# Altium schematic sheet Drive Select.SchDoc
size B; SheetNumber: 14; SheetTotal: 14
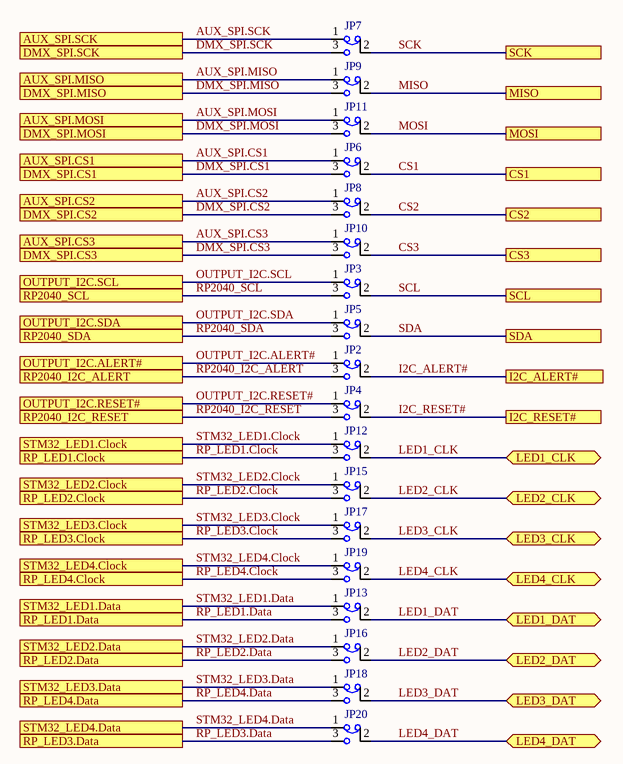
[diagram p0: Drive Select.SchDoc]

## Parts
JP2  Jumper 3 x 1 Bridge 1-2 Solder Bridge  [Jumper 3 Solder Bridge 1-2 0603]  (value not drawn)
JP3  Jumper 3 x 1 Bridge 1-2 Solder Bridge  [Jumper 3 Solder Bridge 1-2 0603]  (value not drawn)
JP4  Jumper 3 x 1 Bridge 1-2 Solder Bridge  [Jumper 3 Solder Bridge 1-2 0603]  (value not drawn)
JP5  Jumper 3 x 1 Bridge 1-2 Solder Bridge  [Jumper 3 Solder Bridge 1-2 0603]  (value not drawn)
JP6  Jumper 3 x 1 Bridge 1-2 Solder Bridge  [Jumper 3 Solder Bridge 1-2 0603]  (value not drawn)
JP7  Jumper 3 x 1 Bridge 1-2 Solder Bridge  [Jumper 3 Solder Bridge 1-2 0603]  (value not drawn)
JP8  Jumper 3 x 1 Bridge 1-2 Solder Bridge  [Jumper 3 Solder Bridge 1-2 0603]  (value not drawn)
JP9  Jumper 3 x 1 Bridge 1-2 Solder Bridge  [Jumper 3 Solder Bridge 1-2 0603]  (value not drawn)
JP10  Jumper 3 x 1 Bridge 1-2 Solder Bridge  [Jumper 3 Solder Bridge 1-2 0603]  (value not drawn)
JP11  Jumper 3 x 1 Bridge 1-2 Solder Bridge  [Jumper 3 Solder Bridge 1-2 0603]  (value not drawn)
JP12  Jumper 3 x 1 Bridge 1-2 Solder Bridge  [Jumper 3 Solder Bridge 1-2 0603]  (value not drawn)
JP13  Jumper 3 x 1 Bridge 1-2 Solder Bridge  [Jumper 3 Solder Bridge 1-2 0603]  (value not drawn)
JP15  Jumper 3 x 1 Bridge 1-2 Solder Bridge  [Jumper 3 Solder Bridge 1-2 0603]  (value not drawn)
JP16  Jumper 3 x 1 Bridge 1-2 Solder Bridge  [Jumper 3 Solder Bridge 1-2 0603]  (value not drawn)
JP17  Jumper 3 x 1 Bridge 1-2 Solder Bridge  [Jumper 3 Solder Bridge 1-2 0603]  (value not drawn)
JP18  Jumper 3 x 1 Bridge 1-2 Solder Bridge  [Jumper 3 Solder Bridge 1-2 0603]  (value not drawn)
JP19  Jumper 3 x 1 Bridge 1-2 Solder Bridge  [Jumper 3 Solder Bridge 1-2 0603]  (value not drawn)
JP20  Jumper 3 x 1 Bridge 1-2 Solder Bridge  [Jumper 3 Solder Bridge 1-2 0603]  (value not drawn)

## Ports
AUX_SPI.CS1, AUX_SPI.CS2, AUX_SPI.CS3, AUX_SPI.MISO, AUX_SPI.MOSI, AUX_SPI.SCK, CS1, CS2, CS3, DMX_SPI.CS1, DMX_SPI.CS2, DMX_SPI.CS3, DMX_SPI.MISO, DMX_SPI.MOSI, DMX_SPI.SCK, I2C_ALERT#, I2C_RESET#, LED1_CLK (bidir), LED1_DAT (bidir), LED2_CLK (bidir), LED2_DAT (bidir), LED3_CLK (bidir), LED3_DAT (bidir), LED4_CLK (bidir), LED4_DAT (bidir), MISO, MOSI, OUTPUT_I2C.ALERT#, OUTPUT_I2C.RESET#, OUTPUT_I2C.SCL, OUTPUT_I2C.SDA, RP2040_I2C_ALERT, RP2040_I2C_RESET, RP2040_SCL, RP2040_SDA, RP_LED1.Clock, RP_LED1.Data, RP_LED2.Clock, RP_LED2.Data, RP_LED3.Clock, RP_LED3.Data, RP_LED4.Clock, RP_LED4.Data, SCK, SCL, SDA, STM32_LED1.Clock, STM32_LED1.Data, STM32_LED2.Clock, STM32_LED2.Data, STM32_LED3.Clock, STM32_LED3.Data, STM32_LED4.Clock, STM32_LED4.Data

## Nets
AUX_SPI.CS1: JP6.1 ; port AUX_SPI.CS1
AUX_SPI.CS2: JP8.1 ; port AUX_SPI.CS2
AUX_SPI.CS3: JP10.1 ; port AUX_SPI.CS3
AUX_SPI.MISO: JP9.1 ; port AUX_SPI.MISO
AUX_SPI.MOSI: JP11.1 ; port AUX_SPI.MOSI
AUX_SPI.SCK: JP7.1 ; port AUX_SPI.SCK
CS1: JP6.2 ; port CS1
CS2: JP8.2 ; port CS2
CS3: JP10.2 ; port CS3
DMX_SPI.CS1: JP6.3 ; port DMX_SPI.CS1
DMX_SPI.CS2: JP8.3 ; port DMX_SPI.CS2
DMX_SPI.CS3: JP10.3 ; port DMX_SPI.CS3
DMX_SPI.MISO: JP9.3 ; port DMX_SPI.MISO
DMX_SPI.MOSI: JP11.3 ; port DMX_SPI.MOSI
DMX_SPI.SCK: JP7.3 ; port DMX_SPI.SCK
I2C_ALERT#: JP2.2 ; port I2C_ALERT#
I2C_RESET#: JP4.2 ; port I2C_RESET#
LED1_CLK: JP12.2 ; port LED1_CLK
LED1_DAT: JP13.2 ; port LED1_DAT
LED2_CLK: JP15.2 ; port LED2_CLK
LED2_DAT: JP16.2 ; port LED2_DAT
LED3_CLK: JP17.2 ; port LED3_CLK
LED3_DAT: JP18.2 ; port LED3_DAT
LED4_CLK: JP19.2 ; port LED4_CLK
LED4_DAT: JP20.2 ; port LED4_DAT
MISO: JP9.2 ; port MISO
MOSI: JP11.2 ; port MOSI
OUTPUT_I2C.ALERT#: JP2.1 ; port OUTPUT_I2C.ALERT#
OUTPUT_I2C.RESET#: JP4.1 ; port OUTPUT_I2C.RESET#
OUTPUT_I2C.SCL: JP3.1 ; port OUTPUT_I2C.SCL
OUTPUT_I2C.SDA: JP5.1 ; port OUTPUT_I2C.SDA
RP2040_I2C_ALERT: JP2.3 ; port RP2040_I2C_ALERT
RP2040_I2C_RESET: JP4.3 ; port RP2040_I2C_RESET
RP2040_SCL: JP3.3 ; port RP2040_SCL
RP2040_SDA: JP5.3 ; port RP2040_SDA
RP_LED1.Clock: JP12.3 ; port RP_LED1.Clock
RP_LED1.Data: JP13.3 ; port RP_LED1.Data
RP_LED2.Clock: JP15.3 ; port RP_LED2.Clock
RP_LED2.Data: JP16.3 ; port RP_LED2.Data
RP_LED3.Clock: JP17.3 ; port RP_LED3.Clock
RP_LED3.Data: JP20.3 ; port RP_LED3.Data
RP_LED4.Clock: JP19.3 ; port RP_LED4.Clock
RP_LED4.Data: JP18.3 ; port RP_LED4.Data
SCK: JP7.2 ; port SCK
SCL: JP3.2 ; port SCL
SDA: JP5.2 ; port SDA
STM32_LED1.Clock: JP12.1 ; port STM32_LED1.Clock
STM32_LED1.Data: JP13.1 ; port STM32_LED1.Data
STM32_LED2.Clock: JP15.1 ; port STM32_LED2.Clock
STM32_LED2.Data: JP16.1 ; port STM32_LED2.Data
STM32_LED3.Clock: JP17.1 ; port STM32_LED3.Clock
STM32_LED3.Data: JP18.1 ; port STM32_LED3.Data
STM32_LED4.Clock: JP19.1 ; port STM32_LED4.Clock
STM32_LED4.Data: JP20.1 ; port STM32_LED4.Data

## Library data of the parts
JP2-JP13 JP15-JP20 = CMP-009-00341-2: 0603 Solder Bridge Jumper Surface Mount; Voltage Rating: 75V; Tolerance: 1%; Value: 0; RoHS Compliant: Yes; Mounting Technology: Surface Mount; Max Operating Temperature: 155°C; Min Operating Temperature: -55°C; Pins: 2; Case/Package: 0603